# EAGLE design DASS01_CV_Amp (EAGLE 9.0.1)
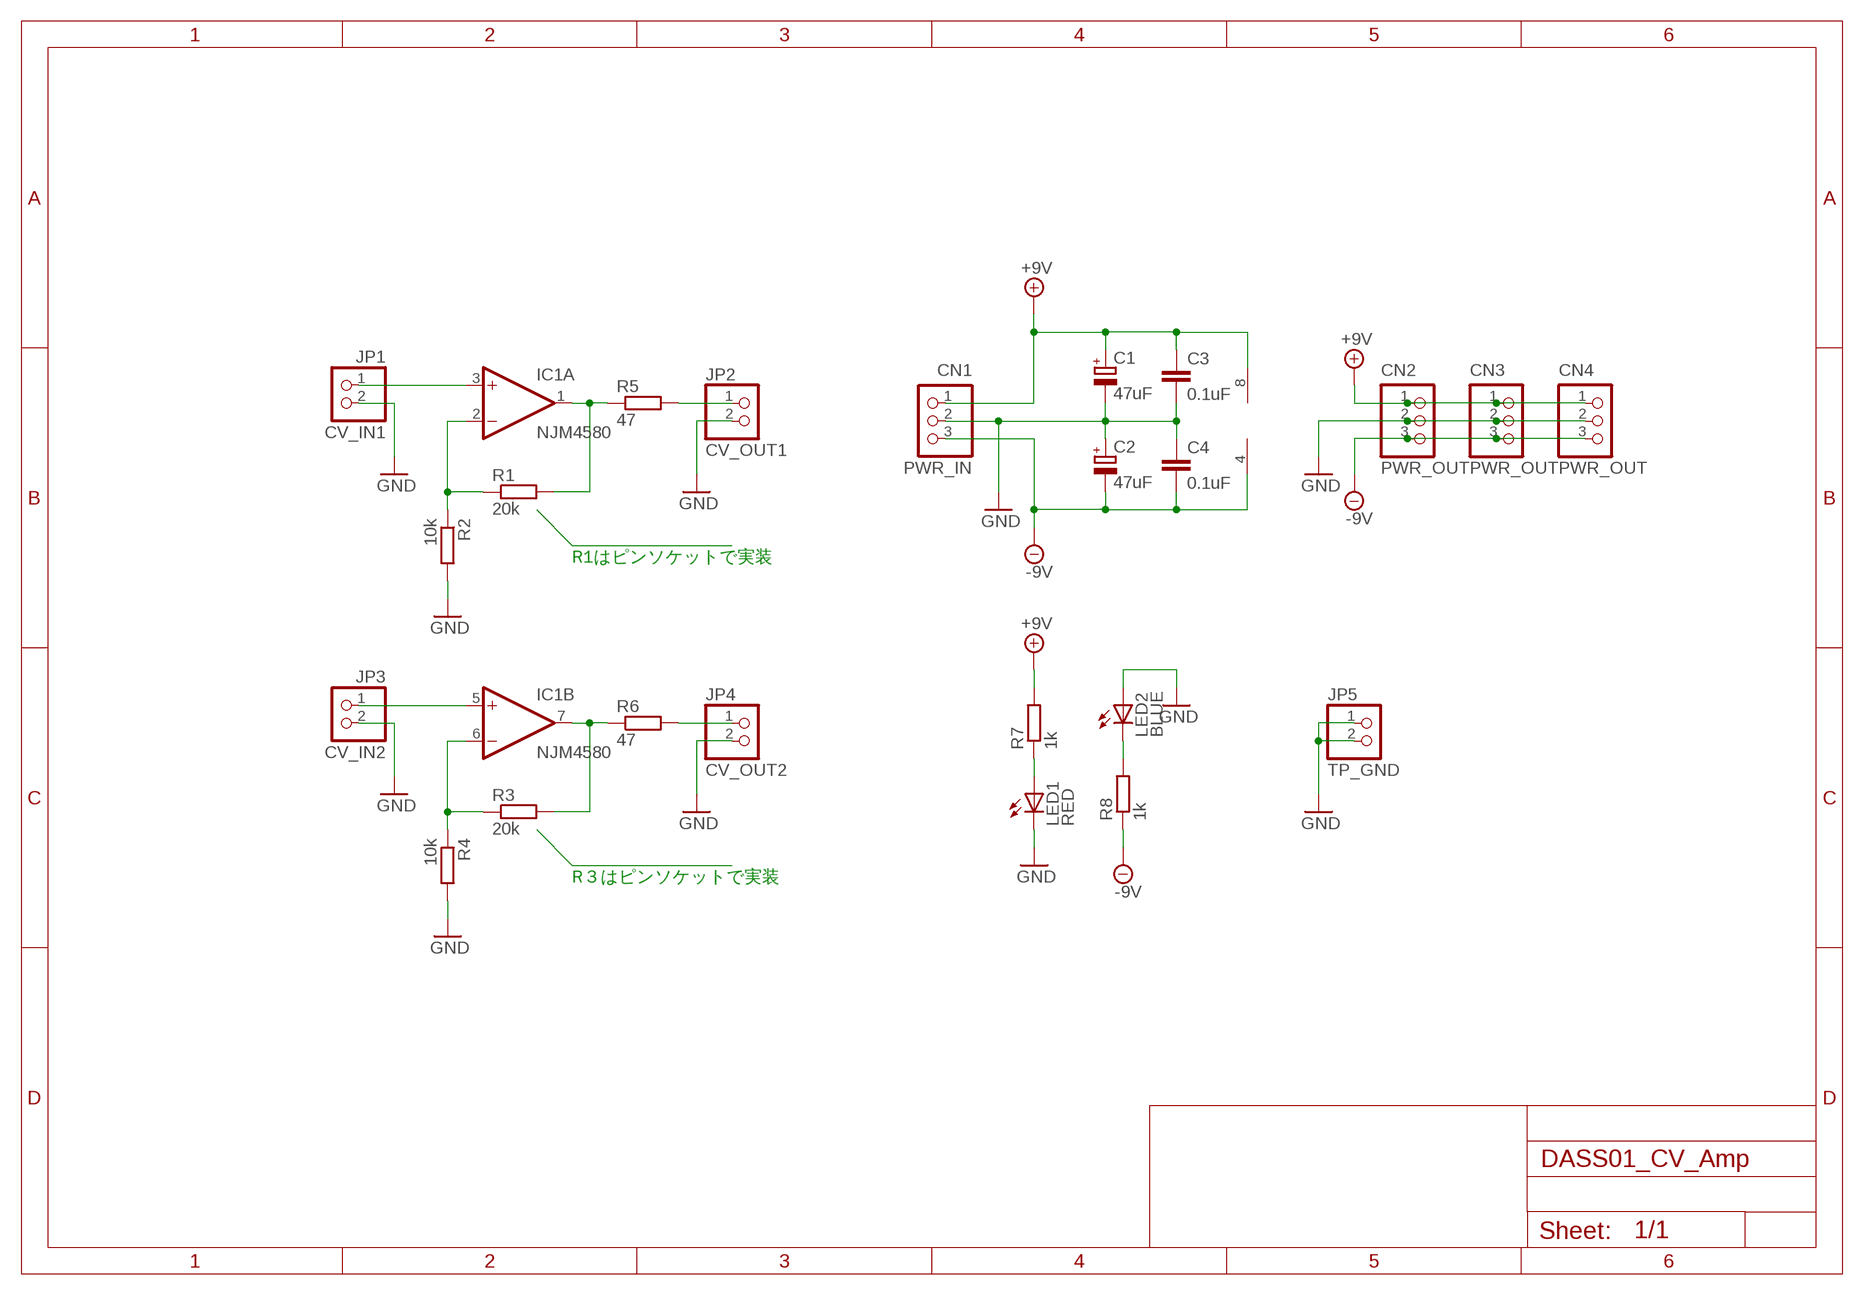
[diagram p0: schematic, sheet 1]

## Parts
C1  47uF  CPOL-EUE2.5-7  [E2,5-7]
C2  47uF  CPOL-EUE2.5-7  [E2,5-7]
C3  0.1uF  C-EU025-024X044  [C025-024X044]
C4  0.1uF  C-EU025-024X044  [C025-024X044]
CN1  PWR_IN  B3B-XH-A  [B3B-XH-A]
CN2  PWR_OUT  B3B-XH-A  [B3B-XH-A]
CN3  PWR_OUT  B3B-XH-A  [B3B-XH-A]
CN4  PWR_OUT  B3B-XH-A  [B3B-XH-A]
IC1  NJM4580  RC4559N  [DIL08]
JP1  CV_IN1  PINHD-1X2  [1X02]
JP2  CV_OUT1  PINHD-1X2  [1X02]
JP3  CV_IN2  PINHD-1X2  [1X02]
JP4  CV_OUT2  PINHD-1X2  [1X02]
JP5  TP_GND  PINHD-1X2  [1X02]
LED1  RED  LED3MM  [LED3MM]
LED2  BLUE  LED3MM  [LED3MM]
R1  20k  R-EU_0207/7  [0207/7]
R2  10k  R-EU_0207/7  [0207/7]
R3  20k  R-EU_0207/7  [0207/7]
R4  10k  R-EU_0207/7  [0207/7]
R5  47  R-EU_0207/7  [0207/7]
R6  47  R-EU_0207/7  [0207/7]
R7  1k  R-EU_0207/7  [0207/7]
R8  1k  R-EU_0207/7  [0207/7]

## Nets
+9V: C1.+ C3.1 CN1.1 CN2.1 CN3.1 CN4.1 IC1.8(P:V+) R7.2
-9V: C2.- C4.2 CN1.3 CN2.3 CN3.3 CN4.3 IC1.4(P:V-) R8.1
GND: C1.- C2.+ C3.2 C4.1 CN1.2 CN2.2 CN3.2 CN4.2 JP1.2 JP2.2 JP3.2 JP4.2 JP5.1 JP5.2 LED1.K(C) LED2.A R2.2 R4.2
N$1: IC1.2(A:-IN) R1.1 R2.1
N$2: IC1.1(A:OUT) R1.2 R5.1
N$3: IC1.3(A:+IN) JP1.1
N$4: IC1.6(B:-IN) R3.1 R4.1
N$5: IC1.7(B:OUT) R3.2 R6.1
N$6: IC1.5(B:+IN) JP3.1
N$7: JP2.1 R5.2
N$8: JP4.1 R6.2
N$9: LED2.K(C) R8.2
N$17: LED1.A R7.1

## Notes on the sheet
- R1はピンソケットで実装
- R３はピンソケットで実装

## Library data of the parts
C1 C2 = rcl:CPOL-EU: POLARIZED CAPACITOR, European symbol; SPICEPREFIX: C
C3 C4 = rcl:C-EU: CAPACITOR, European symbol; SPICEPREFIX: C
CN1-CN4 = jst-xh:B3B-XH-A: Wire-to-Board 2.5mm pitch top mount connector Source: http://www.jst-mfg.com/product/pdf/jpn/XH.pdf http://www.jst-mfg.com/product/detail.php?series=277
IC1 = linear:RC4559: OP AMP
JP1-JP5 = pinhead:PINHD-1X2: PIN HEADER
LED1 LED2 = led:LED: LED OSRAM: - CHIPLED LG R971, LG N971, LY N971, LG Q971, LY Q971, LO R971, LY R971 LH N974, LH R974 LS Q976, LO Q976, LY Q976 LO Q996 - Hyper CHIPLED LW Q18S LB Q993, LB Q99A, LB R99A - SideLED LS A670, LO A670, LY A670, LG A670, LP A670 LB A673, LV A673, LT A673, LW A673 LH A674 LY A675 LS A676, LA A676, LO A676, LY A676, LW A676 LS A679, LY A679, LG A679 - Hyper Micro SIDELED® LS Y876, LA Y876, LO Y876, LY Y876 LT Y87S - SmartLED LW L88C, LW L88S LB L89C, LB L89S, LG L890 LS L89K, LO L89K, LY L89K LS L896, LA L896, LO L896, LY L896 - TOPLED LS T670, LO T670, LY T670, LG T670, LP T670 LSG T670, LSP T670, LSY T670, LOP T670, LYG T670 LG T671, LOG T671, LSG T671 LB T673, LV T673, LT T673, LW T673 LH T674 LS T676, LA T676, LO T676, LY T676, LB T676, LH T676, LSB T676, LW T676 LB T67C, LV T67C, LT T67C, LS T67K, LO T67K, LY T67K, LW E67C LS E67B, LA E67B, LO E67B, LY E67B, LB E67C, LV E67C, LT E67C LW T67C LS T679, LY T679, LG T679 LS T770, LO T770, LY T770, LG T770, LP T770 LB T773, LV T773, LT T773, LW T773 LH T774 LS E675, LA E675, LY E675, LS T675 LS T776, LA T776, LO T776, LY T776, LB T776 LHGB T686 LT T68C, LB T68C - Hyper Mini TOPLED® LB M676 - Mini TOPLED Santana® LG M470 LS M47K, LO M47K, LY M47K Source: http://www.osram.convergy.de LUXEON: - LUMILED® LXK2-PW12-R00, LXK2-PW12-S00, LXK2-PW14-U00, LXK2-PW14-V00 LXK2-PM12-R00, LXK2-PM12-S00, LXK2-PM14-U00 LXK2-PE12-Q00, LXK2-PE12-R00, LXK2-PE12-S00, LXK2-PE14-T00, LXK2-PE14-U00 LXK2-PB12-K00, LXK2-PB12-L00, LXK2-PB12-M00, LXK2-PB14-N00, LXK2-PB14-P00, LXK2-PB14-Q00 LXK2-PR12-L00, LXK2-PR12-M00, LXK2-PR14-Q00, LXK2-PR14-R00 LXK2-PD12-Q00, LXK2-PD12-R00, LXK2-PD12-S00 LXK2-PH12-R00, LXK2-PH12-S00 LXK2-PL12-P00, LXK2-PL12-Q00, LXK2-PL12-R00 Source: www.luxeon.com KINGBRIGHT: KA-3528ASYC Source: www.kingbright.com
R1-R8 = rcl:R-EU_: RESISTOR, European symbol; SPICEPREFIX: R

## Board
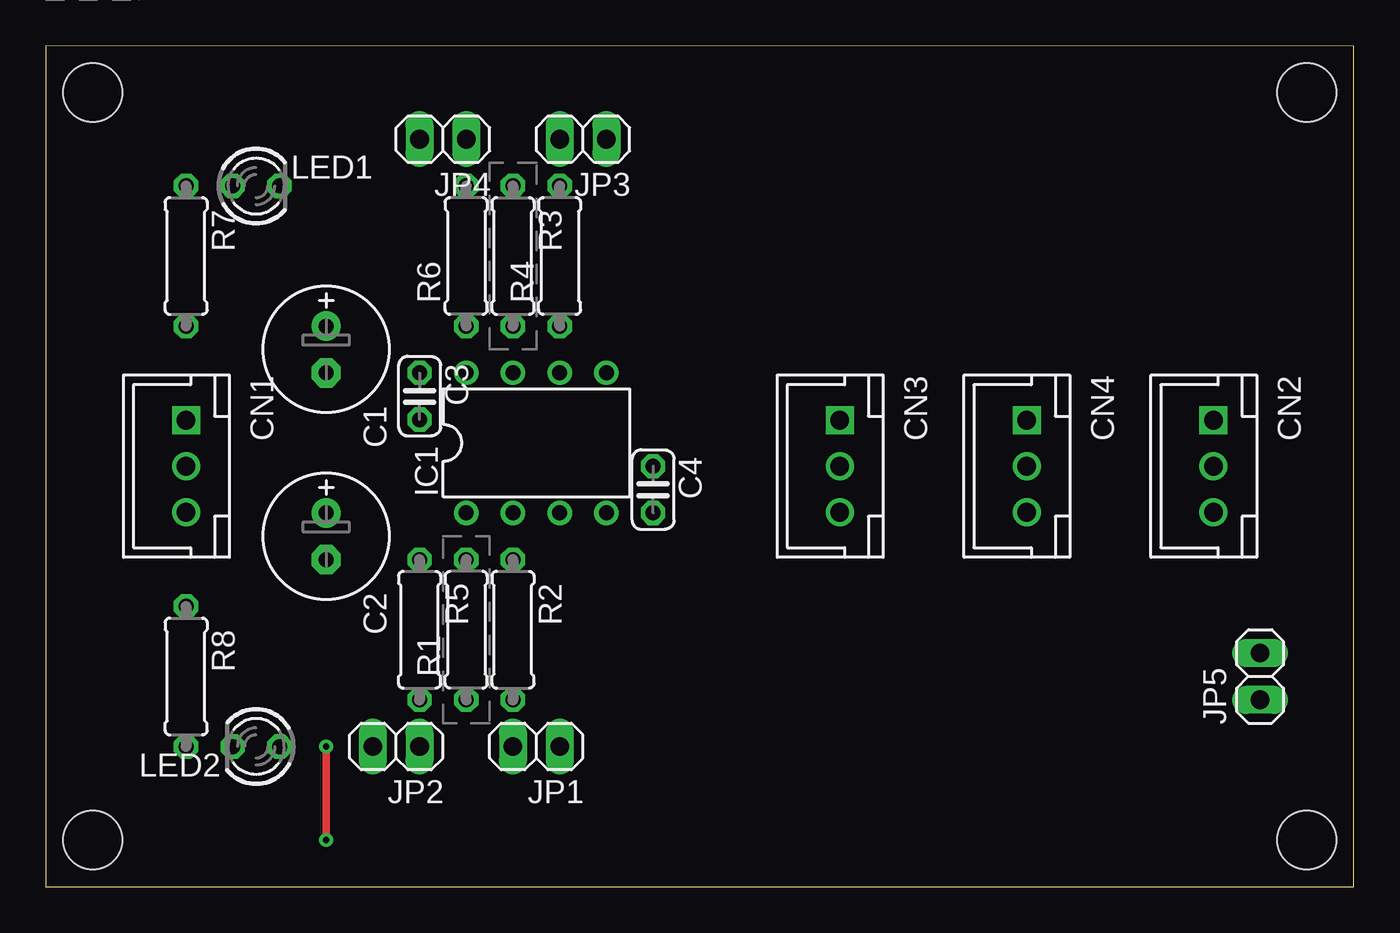
[diagram p1: board, top side]
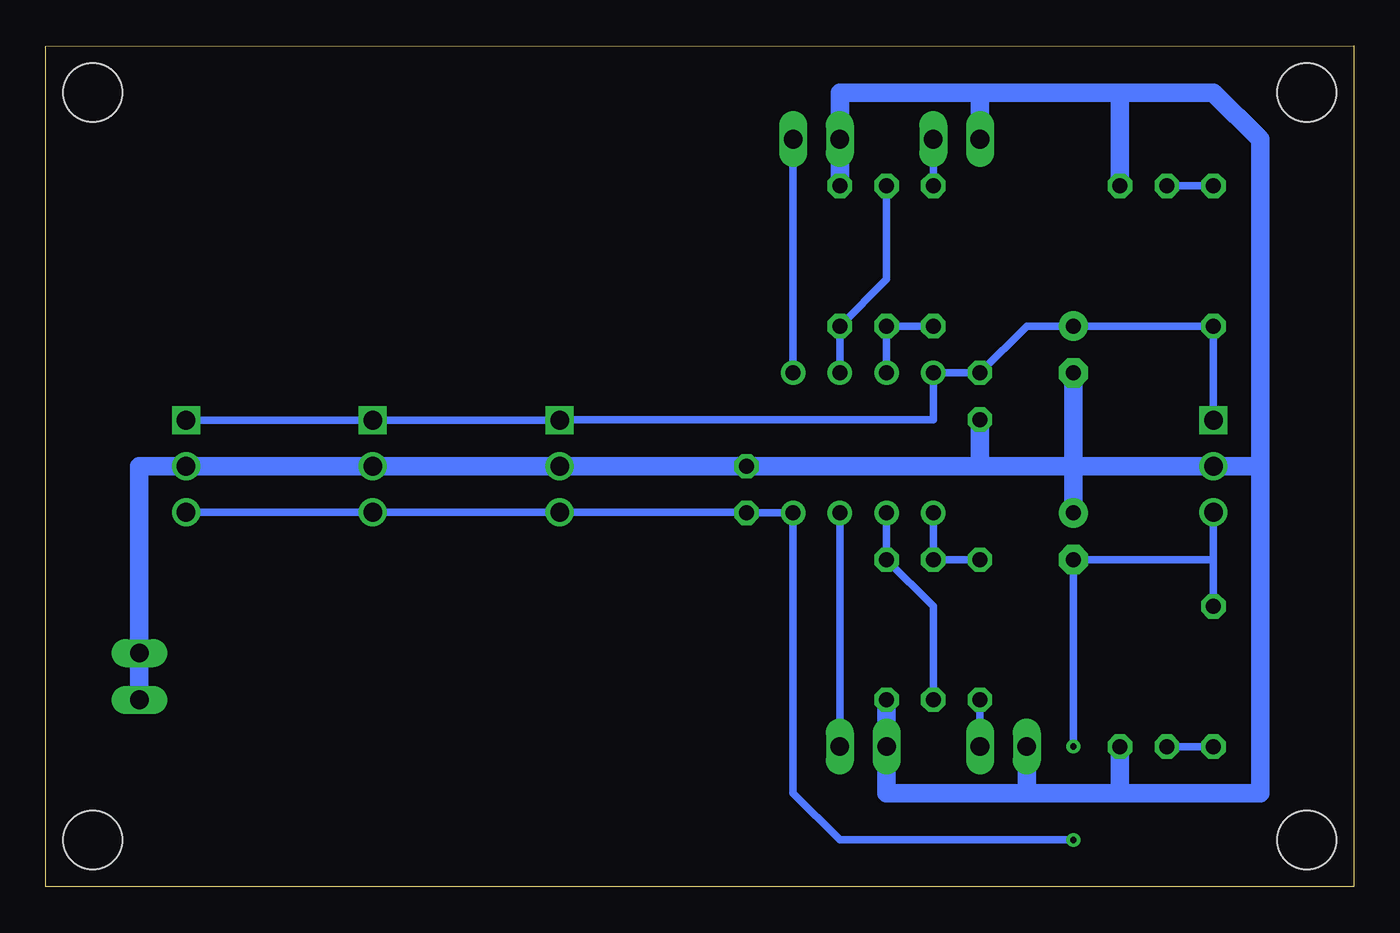
[diagram p2: board, bottom side, seen from below]

Size 71.12 x 45.72 mm. Coordinates in mm from the lower left corner, seen from the top.
Outline: 0,0.01 71.12,0 71.12,45.71 0,45.72 0,0.01
Copper layers (1*16): Top 0.035mm / dielectric 1.5mm / Bottom 0.035mm
Design rules "default": minimum track width 6mil, minimum drill 0.35mm, track to track 6mil, track to pad 6mil, pad to pad 6mil, via to via 6mil, smd to smd 6mil, copper to edge 40mil, drill to drill 6mil, minimum pad ring 10mil, minimum via ring 8mil, stop-mask expansion 4mil, vias tented up to drill 0mil, thermal gap 10mil
Holes 3.2 mm at 2.54,43.19 2.54,2.55 68.58,43.19 68.58,2.55

### Footprints (pad centres in the part's own frame; a part is rotated, then mirrored left to right if it is on the bottom)
E2,5-7 = drill 0.813 pad 1.6: + -1.27,0 | drill 0.813 pad 1.6 octagon: - 1.27,0
C025-024X044 = drill 0.813 octagon: 1 -1.27,0; 2 1.27,0
B3B-XH-A = drill 1.016 square: 1 -2.5,0 | drill 1.016: 2 0,0; 3 2.5,0
DIL08 = drill 0.813 pad 1.27: 1 -3.81,-3.81; 2 -1.27,-3.81; 3 1.27,-3.81; 4 3.81,-3.81; 5 3.81,3.81; 6 1.27,3.81; 7 -1.27,3.81; 8 -3.81,3.81
1X02 = drill 1.016 long: 1 -1.27,0; 2 1.27,0
LED3MM = drill 0.813 octagon: A -1.27,0; K 1.27,0
0207/7 = drill 0.813 octagon: 1 -3.81,0; 2 3.81,0

### Placement (x,y rotation side)
C1  15.24,29.22 270 top
C2  15.24,19.06 270 top
C3  20.32,26.68 270 top
C4  33.02,21.6 270 top
CN1  7.62,22.87 270 top
CN2  63.5,22.87 270 top
CN3  43.18,22.87 270 top
CN4  53.34,22.87 270 top
IC1  26.67,24.14 0 top
JP1  26.67,7.63 180 top
JP2  19.05,7.63 180 top
JP3  29.21,40.65 180 top
JP4  21.59,40.65 180 top
JP5  66.04,11.44 90 top
LED1  11.43,38.11 0 top
LED2  11.43,7.63 180 top
R1  22.86,13.98 90 top
R2  25.4,13.98 270 top
R3  25.4,34.3 270 top
R4  27.94,34.3 90 top
R5  20.32,13.98 270 top
R6  22.86,34.3 90 top
R7  7.62,34.3 270 top
R8  7.62,11.44 270 top

### Tracks (layer width: path | path; a pad name or v marks a point on that pad's centre or on a via)
+9V
  Bottom 0.406: CN1.1 R7.2 C1.+ 17.78,30.49 C3.1 IC1.8 22.86,25.41 43.18,25.41 CN3.1 CN4.1 CN2.1
-9V  (via drill 0.35)
  Top 0.406: v15.24,7.63 v15.24,2.55
  Bottom 0.406: CN1.3 7.62,17.79 | 7.62,17.79 R8.1 | 7.62,17.79 C2.- v15.24,7.63 | CN2.3 CN4.3 CN3.3 33.06,20.37 C4.2 IC1.4 30.48,5.09 27.94,2.55 v15.24,2.55
GND
  Bottom 1.016: R4.2 JP3.2 27.94,43.19 20.32,43.19 | 20.32,43.19 12.7,43.19 | 12.7,43.19 7.62,43.19 5.08,40.65 5.08,22.87 | 5.08,22.87 CN1.2 15.24,22.87 | LED1.K 12.7,43.19 | 15.24,22.87 20.32,22.87 | 20.32,22.87 C4.1 CN3.2 CN4.2 CN2.2 66.04,22.87 JP5.2 JP5.1 | C2.+ 15.24,22.87 | C1.- 15.24,22.87 | C3.2 20.32,22.87 | JP2.2 17.78,5.09 | 17.78,5.09 12.7,5.09 | 12.7,5.09 5.08,5.09 5.08,22.87 | LED2.A 12.7,5.09 | R2.2 JP1.2 25.4,5.09 17.78,5.09 | JP4.2 20.32,43.19
N$1
  Bottom 0.406: IC1.2 R2.1 22.86,15.25 R1.1
N$2
  Bottom 0.406: IC1.1 R1.2 R5.1
N$3
  Bottom 0.406: IC1.3 JP1.1
N$4
  Bottom 0.406: IC1.6 R4.1 25.4,33.03 R3.1
N$5
  Bottom 0.406: IC1.7 R3.2 R6.1
N$6
  Bottom 0.406: JP3.1 IC1.5
N$7
  Bottom 0.406: R5.2 JP2.1
N$8
  Bottom 0.406: R6.2 JP4.1
N$9
  Bottom 0.406: LED2.K R8.2
N$17
  Bottom 0.406: R7.1 LED1.A

### Text on the board
tDocu: はピンソケットで実装 | DASS01-CV-AMP | http://dad8893.blogspot.com/